# Altium schematic sheet TapDriver-ESP32.schdoc
size 278 x 178 mm
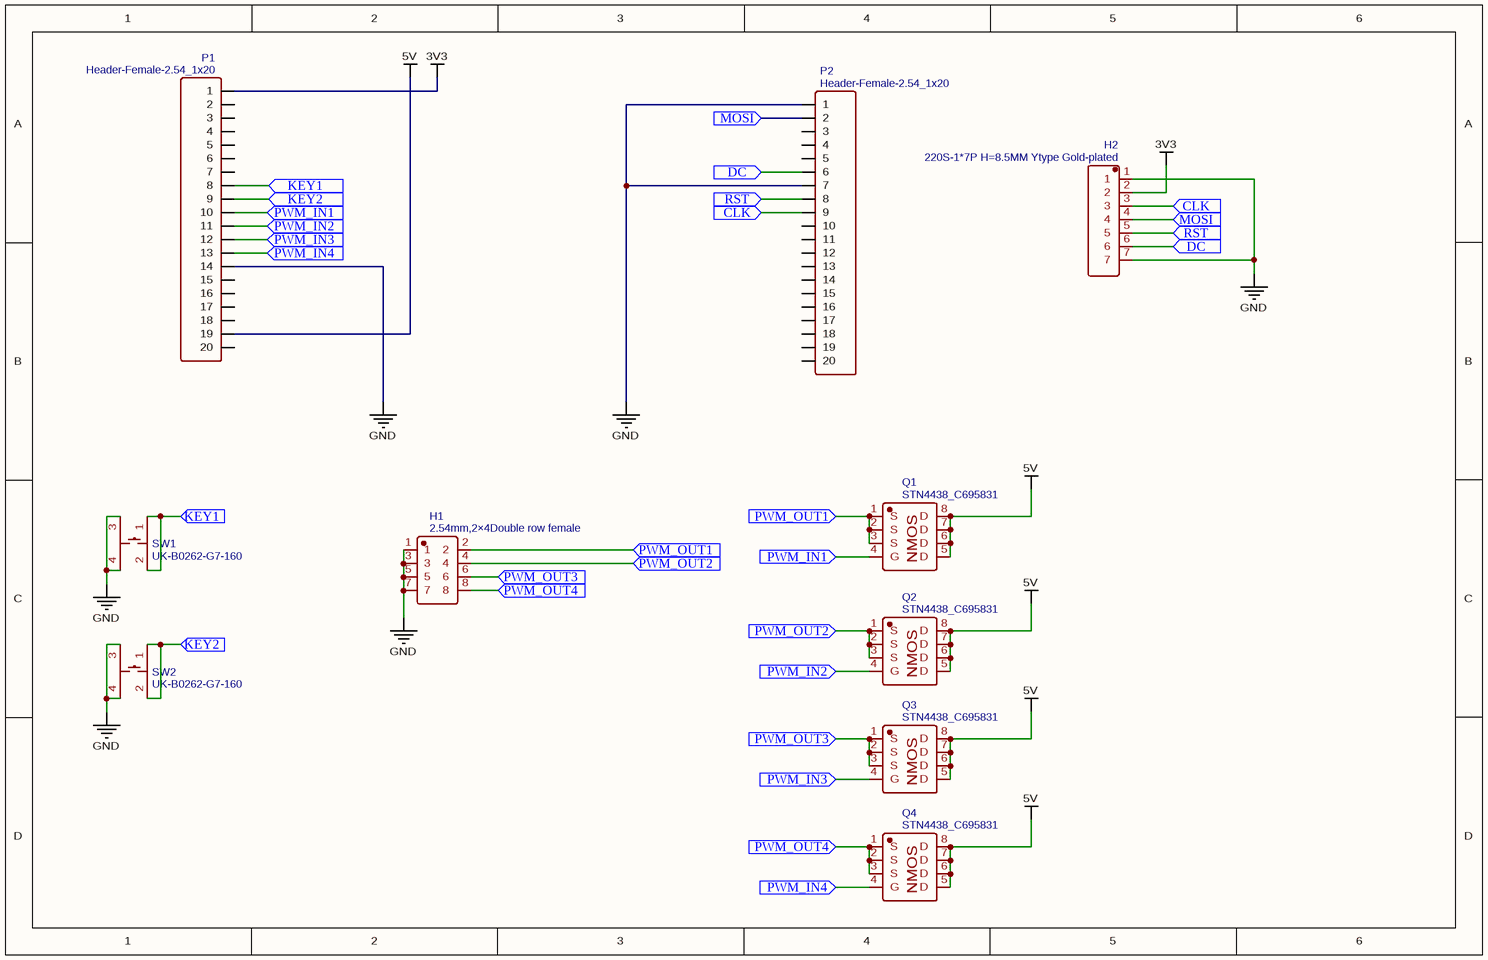
[diagram p0: TapDriver-ESP32.schdoc]

## Parts
H1  2.54mm,2×4Double row female  [HDR-TH_8P-P2.54-V-F-R2-C4-S2.54-1]
H2  220S-1*7P H=8.5MM Ytype Gold-plated  [HDR-TH_7P-P2.54-V-F]
P1  Header-Female-2.54_1x20  [HDR-TH_20P-P2.54-V-F]
P2  Header-Female-2.54_1x20  [HDR-TH_20P-P2.54-V-F]
Q1  STN4438_C695831  [SOP-8_L4.9-W3.9-P1.27-LS6.0-BL]
Q2  STN4438_C695831  [SOP-8_L4.9-W3.9-P1.27-LS6.0-BL]
Q3  STN4438_C695831  [SOP-8_L4.9-W3.9-P1.27-LS6.0-BL]
Q4  STN4438_C695831  [SOP-8_L4.9-W3.9-P1.27-LS6.0-BL]
SW1  UK-B0262-G7-160  [SW-SMD_4P-L12.0-W12.0-P5.00-LS15.0]
SW2  UK-B0262-G7-160  [SW-SMD_4P-L12.0-W12.0-P5.00-LS15.0]

## Ports
CLK (in), DC (in), KEY1 (in), KEY2 (in), MOSI (in), PWM_IN1 (in), PWM_IN2 (in), PWM_IN3 (in), PWM_IN4 (in), PWM_OUT1 (in), PWM_OUT2 (in), PWM_OUT3 (in), PWM_OUT4 (in), RST (in)

## Nets
3V3: H2.2 P1.1
5V: P1.19 Q1.5(D) Q1.6(D) Q1.7(D) Q1.8(D) Q2.5(D) Q2.6(D) Q2.7(D) Q2.8(D) Q3.5(D) Q3.6(D) Q3.7(D) Q3.8(D) Q4.5(D) Q4.6(D) Q4.7(D) Q4.8(D)
GND: H1.1 H1.3 H1.5 H1.7 H2.1 H2.7 P1.14 P2.1 P2.7 SW1.3 SW1.4 SW2.3 SW2.4
CLK: H2.3 P2.9 ; port CLK
DC: H2.6 P2.6 ; port DC
KEY1: P1.8 SW1.1 SW1.2 ; port KEY1
KEY2: P1.9 SW2.1 SW2.2 ; port KEY2
MOSI: H2.4 P2.2 ; port MOSI
PWM_IN1: P1.10 Q1.4(G) ; port PWM_IN1
PWM_IN2: P1.11 Q2.4(G) ; port PWM_IN2
PWM_IN3: P1.12 Q3.4(G) ; port PWM_IN3
PWM_IN4: P1.13 Q4.4(G) ; port PWM_IN4
PWM_OUT1: H1.2 Q1.1(S) Q1.2(S) Q1.3(S) ; port PWM_OUT1
PWM_OUT2: H1.4 Q2.1(S) Q2.2(S) Q2.3(S) ; port PWM_OUT2
PWM_OUT3: H1.6 Q3.1(S) Q3.2(S) Q3.3(S) ; port PWM_OUT3
PWM_OUT4: H1.8 Q4.1(S) Q4.2(S) Q4.3(S) ; port PWM_OUT4
RST: H2.5 P2.8 ; port RST

Not connected (* = marked no-connect by the designer): P1 2 3 4 5 6 7 15 16 17 18 20; P2 3 4 5 10 11 12 13 14 15 16 17 18 19 20

## Notes on the sheet
- (in symbol STN4438_C695831) NMOS

## Library data of the parts
H1 = 2.54mm,2×4Double row female: BOM_Manufacturer: ReliaPro; BOM_Supplier Part: C58378; BOM_Supplier: LCSC; BOM_Manufacturer Part: 2.54mm,2×4Double row female; spicePre: H; spiceSymbolName: 2.54mm,2×4Double row female
H2 = 220S-1*7P H=8.5MM Ytype Gold-plated: BOM_Manufacturer: Ckmtw; Contributor: LCSC; BOM_Supplier: LCSC; BOM_Manufacturer Part: 220S-1*7P H=8.5MM Ytype Gold-plated; BOM_Supplier Part: C124418; BOM_JLCPCB Part Class: Extended Part; spicePre: H; spiceSymbolName: 220S-1*7P H=8.5MM Ytype Gold-plated
P1 P2 = Header-Female-2.54_1x20: BOM_Manufacturer: BOOMELE; BOM_Manufacturer Part: 2.54mm 1*20P Female header; BOM_Supplier: LCSC; BOM_Supplier Part: C50984; BOM_JLCPCB Part Class: Extended Part; spicePre: P; spiceSymbolName: Header-Female-2.54_1x20
Q1-Q4 = STN4438_C695831: BOM_Manufacturer: UMW(友台半导体); Contributor: LCSC; BOM_Supplier: LCSC; BOM_Supplier Part: C695831; BOM_Manufacturer Part: STN4438; BOM_JLCPCB Part Class: Extended Part; spicePre: Q; spiceSymbolName: STN4438_C695831
SW1 SW2 = UK-B0262-G7-160: BOM_Manufacturer: USAKRO; Contributor: LCSC; BOM_Supplier: LCSC; BOM_Supplier Part: C620352; BOM_Manufacturer Part: UK-B0262-G7-160; BOM_JLCPCB Part Class: Extended Part; spicePre: S; spiceSymbolName: UK-B0262-G7-160